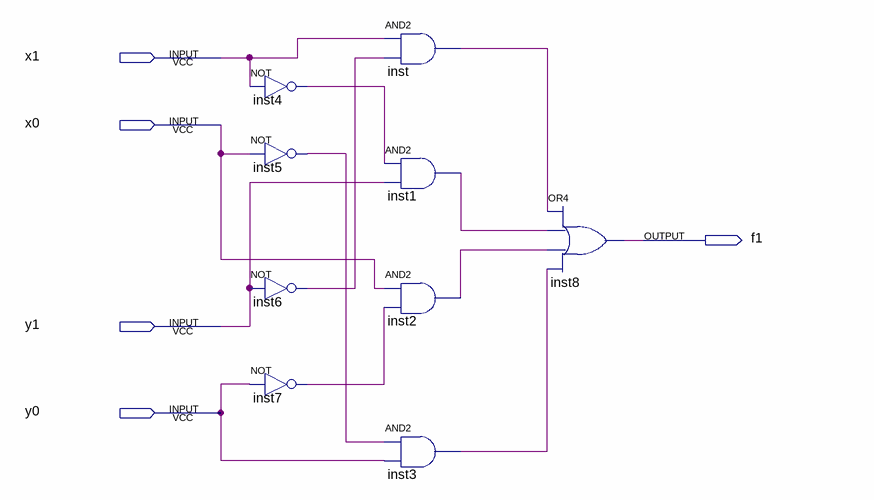
[diagram p0: schematic sheet]
// Quartus schematic dual1.bdf as structural Verilog: 9 symbols, 5 pins
module dual1 (
  input  x1,
  input  x0,
  input  y1,
  input  y0,
  output f1
);

  wire inst1_out, inst2_out, inst3_out, inst4_out, inst5_out, inst6_out, inst7_out, inst_out;

  not inst4 (inst4_out, x1);
  not inst5 (inst5_out, x0);
  not inst6 (inst6_out, y1);
  not inst7 (inst7_out, y0);
  and inst (inst_out, x1, inst6_out);
  and inst1 (inst1_out, inst4_out, y1);
  and inst2 (inst2_out, x0, inst7_out);
  and inst3 (inst3_out, inst5_out, y0);
  or inst8 (f1, inst_out, inst1_out, inst2_out, inst3_out);
endmodule
